# EAGLE board FullBoard (EAGLE 9.3.2), part 1 of 2
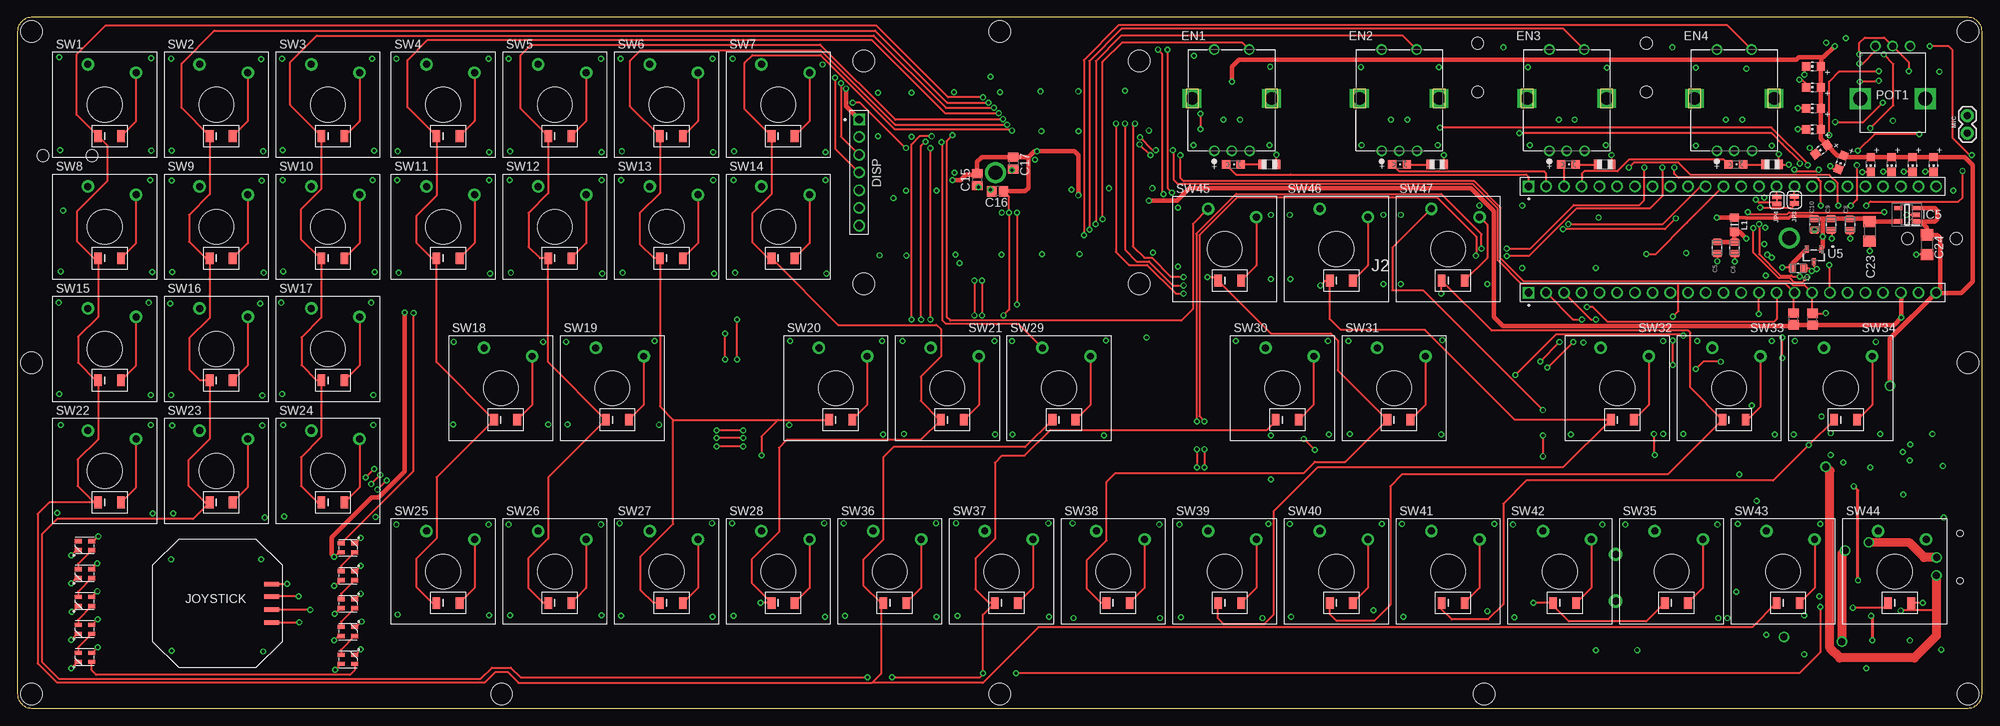
[diagram p3: board, top side]
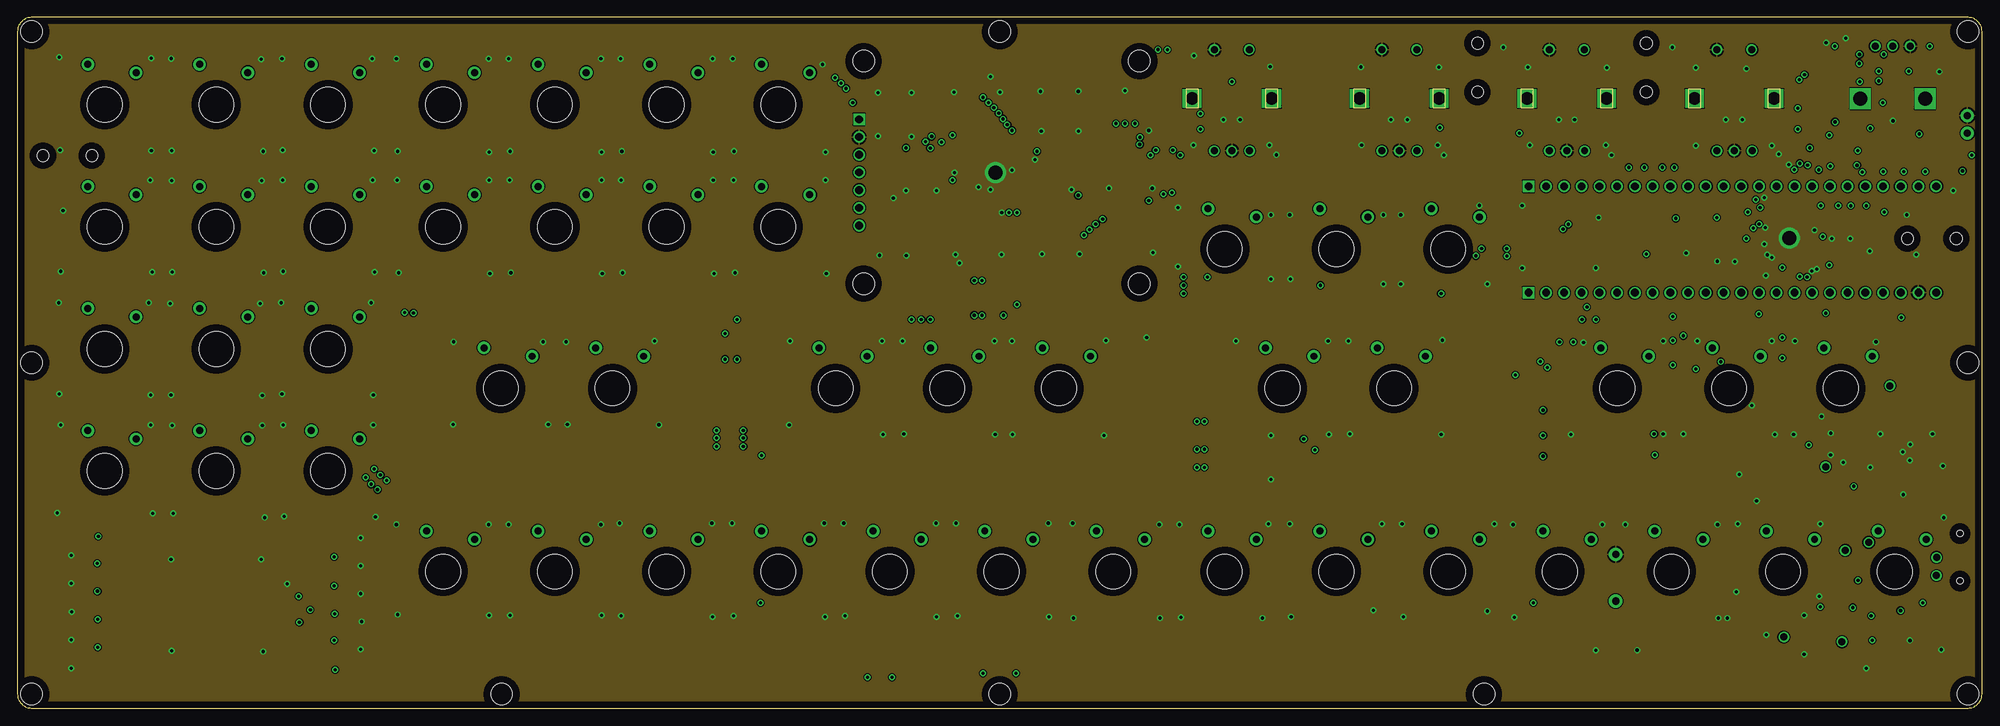
[diagram p4: board, inner layer Route2]
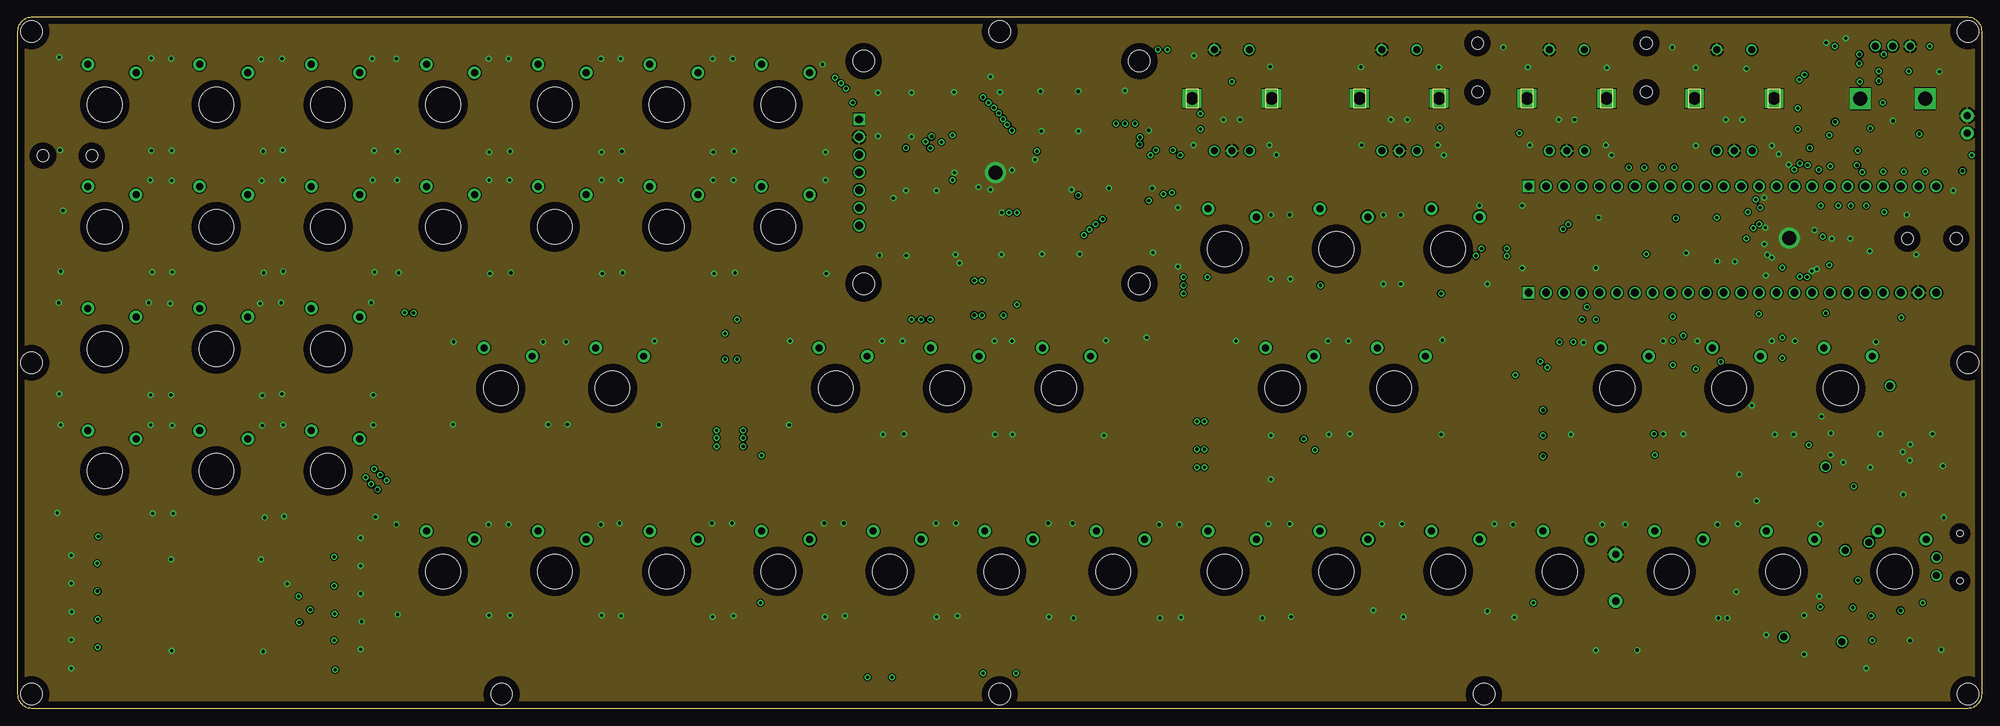
[diagram p5: board, inner layer Route15]
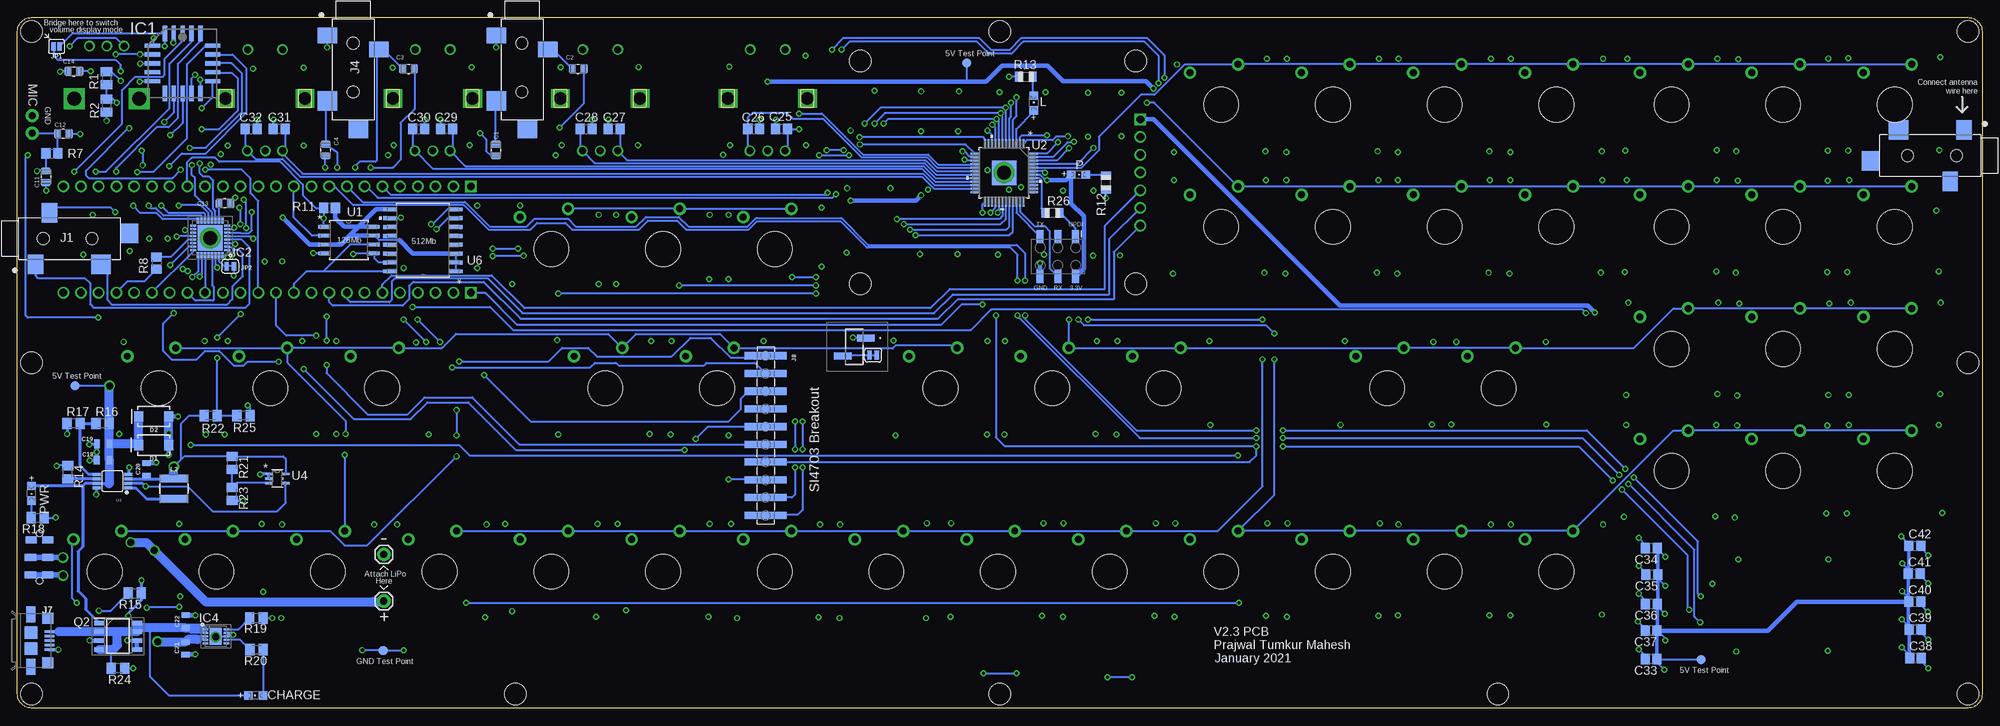
[diagram p6: board, bottom side, seen from below]

Size 281.5 x 99 mm. Coordinates in mm from the lower left corner, seen from the top.
Outline: 0,97 0,2 arc90 2,0 279.5,0 arc90 281.5,2 281.5,97 arc90 279.5,99 2,99 arc90 0,97
Copper layers (1+2*15+16): Top 0.035mm / dielectric 0.2mm / Route2 0.0175mm / dielectric 1.065mm / Route15 0.0175mm / dielectric 0.2mm / Bottom 0.035mm
Design rules "default *": minimum track width 6mil, minimum drill 0.35mm, track to track 6mil, track to pad 6mil, pad to pad 6mil, via to via 6mil, smd to smd 6mil, copper to edge 40mil, drill to drill 6mil, minimum pad ring 10mil, minimum via ring 8mil, stop-mask expansion 4mil, vias tented up to drill 0mil, thermal gap 10mil
Holes 3.1 mm at 121.25,92.74 160.75,92.74 160.75,60.83 121.25,60.83 2,97 2,2 279.5,2 279.5,97 140.75,2 140.75,97 2,49.5 279.5,49.5 210.12,2 69.38,2

## Footprints (pad centres in the part's own frame; a part is rotated, then mirrored left to right if it is on the bottom)
M208770246R = smd 1 x 2.51: 1 -1.27,1.655; 2 1.27,-1.655
SMT-JUMPER_2_NC_TRACE_SILK = smd 0.635 x 1.27: 1 -0.508,0; 2 0.508,0
CAP_0805 = smd 1.05 x 1.38: 1 -0.84,0; 2 0.84,0
C0805 = smd 1.3 x 1.5: 1 -0.85,0; 2 0.85,0
0805 = smd 0.8 x 1.2: 1 -0.9,0; 2 0.9,0
C1206 = smd 1.6 x 1.8: 1 -1.4,0; 2 1.4,0
CHIPLED_0805 = smd 1.2 x 1.2: A 0,-1.05; C 0,1.05
SMA-DIODE = smd 1.27 x 1.47: A -2.15,0; C 2.15,0
61300711121 = drill 1.1 square: 1 -7.62,0 | drill 1.1: 2 -5.08,0; 3 -2.54,0; 4 0,0; 5 2.54,0; 6 5.08,0; 7 7.62,0
PEC11R-4215K-S0024 = drill 1: 1 -2.5,7; 2 2.5,7; A -2.5,-7.5; B 2.55,-7.5; C 0,-7.5 | drill 1.8 square: M1 -5.7,0; M2 5.7,0
PLCC20S = smd 0.6 x 2.2: 1 0,4.3; 2 -1.27,4.3; 3 -2.54,4.3; 9 -2.54,-4.3; 10 -1.27,-4.3; 11 0,-4.3; 12 1.27,-4.3; 13 2.54,-4.3; 19 2.54,4.3; 20 1.27,4.3 | smd 2.2 x 0.6: 4 -4.3,2.54; 5 -4.3,1.27; 6 -4.3,0; 7 -4.3,-1.27; 8 -4.3,-2.54; 14 4.3,-2.54; 15 4.3,-1.27; 16 4.3,0; 17 4.3,1.27; 18 4.3,2.54
QFN50P500X500X90-33N = smd 0.85 x 0.3: 1 -2.45,1.75; 2 -2.45,1.25; 3 -2.45,0.75; 4 -2.45,0.25; 5 -2.45,-0.25; 6 -2.45,-0.75; 7 -2.45,-1.25; 8 -2.45,-1.75; 17 2.45,-1.75; 18 2.45,-1.25; 19 2.45,-0.75; 20 2.45,-0.25; 21 2.45,0.25; 22 2.45,0.75; 23 2.45,1.25; 24 2.45,1.75 | smd 0.3 x 0.85: 9 -1.75,-2.45; 10 -1.25,-2.45; 11 -0.75,-2.45; 12 -0.25,-2.45; 13 0.25,-2.45; 14 0.75,-2.45; 15 1.25,-2.45; 16 1.75,-2.45; 25 1.75,2.45; 26 1.25,2.45; 27 0.75,2.45; 28 0.25,2.45; 29 -0.25,2.45; 30 -0.75,2.45; 31 -1.25,2.45; 32 -1.75,2.45 | smd 3.6 x 3.6: 33 0,0
SON50P300X300X100-11N = smd 0.8 x 0.3: 1 -1.5,1; 2 -1.5,0.5; 3 -1.5,0; 4 -1.5,-0.5; 5 -1.5,-1; 6 1.5,-1; 7 1.5,-0.5; 8 1.5,0; 9 1.5,0.5; 10 1.5,1 | smd 1.75 x 2.45: 11 0,0
SOT95P280X145-5N = smd 1.15 x 0.6: 1 -1.25,0.95; 2 -1.25,0; 3 -1.25,-0.95; 4 1.25,-0.95; 5 1.25,0.95
SJ-3524-SMT-TR = smd 2.2 x 2.8: 1 -3.6,-3.7; 3 -1.6,3.7 | smd 2.8 x 2.8: 2 5.8,-3.7 | smd 2.6 x 2.8: 4 9.8,0.75 | hole 1.7: -2.5,0; 4.5,0
61302411121 = drill 1.1 square: 1 -29.21,0 | drill 1.1: 2 -26.67,0; 3 -24.13,0; 4 -21.59,0; 5 -19.05,0; 6 -16.51,0; 7 -13.97,0; 8 -11.43,0; 9 -8.89,0; 10 -6.35,0; 11 -3.81,0; 12 -1.27,0; 13 1.27,0; 14 3.81,0; 15 6.35,0; 16 8.89,0; 17 11.43,0; 18 13.97,0; 19 16.51,0; 20 19.05,0; 21 21.59,0; 22 24.13,0; 23 26.67,0; 24 29.21,0
2X3_SMD = smd 1.02 x 1.9: 1 -2.54,-2.85; 2 -2.54,2.85; 3 0,-2.85; 4 0,2.85; 5 2.54,-2.85; 6 2.54,2.85
1981584-1 = smd 0.4 x 1.35: 1 -1.3,4.1; 2 -0.65,4.1; 3 0,4.1; 4 0.65,4.1; 5 1.3,4.1 | smd 1.8 x 1.8: M1 -1.15,1.45; M2 1.15,1.45 | smd 2.3 x 1.3: S1 -3.75,1.45; S2 3.75,1.45 | smd 1.6 x 1.6: S3 -3.2,3.885; S4 3.2,3.885
1X10_SMD_MALE = smd 1.02 x 6: 1 0,0; 2 2.54,0; 3 5.08,0; 4 7.62,0; 5 10.16,0; 6 12.7,0; 7 15.24,0; 8 17.78,0; 9 20.32,0; 10 22.86,0
1X01 = drill 1.016 pad 1.88: 1 0,0
SMT-JUMPER_2_NO_SILK = smd 0.635 x 1.27: 1 -0.406,0; 2 0.406,0
RC-MASTER-SMD_L0805MP = smd 1.2 x 1.3: 1 -1.016,0; 2 1.016,0
INDUCTOR_4X4MM = smd 4.089 x 1.143: P$1 0,1.473; P$2 0,-1.473
CHIP-LED0805 = smd 1.2 x 1.2: A 0,-1.05; C 0,1.05
1X02 = drill 1.016 pad 1.88: 1 0,0; 2 2.54,0
PO915N_POT = drill 1: ADJ 0,-7.5; V1 -2.5,-7.5; V2 2.5,-7.5 | drill 2 square: P$4 -4.65,0; P$5 4.65,0
SOIC127P600X175-8N = smd 1.5 x 0.65: 1 -2.7,1.905; 2 -2.7,0.635; 3 -2.7,-0.635; 4 -2.7,-1.905; 5 2.7,-1.905; 6 2.7,-0.635; 7 2.7,0.635; 8 2.7,1.905
M0805 = smd 1.3 x 1.6: 1 -0.95,0; 2 0.95,0
R0805 = smd 1.1 x 1.4: 1 -1,0; 2 1,0
R0805' = smd 1.3 x 1.5: 1 -0.85,0; 2 0.85,0
GATERON_LP_PLAIN = drill 1 pad 1.778: 1 -2.4,5.8; SW2 4.5,4.6 | smd 1.1 x 1.65: 2 -0.95,-4.5; A 2.35,-4.5 | hole 5: 0,0
PAD.03X.05 = smd 1.27 x 1.27: P$1 0,0
WIN_S-8_WIN = smd 1.499 x 0.533: 1 -3.658,1.905; 2 -3.658,0.635; 3 -3.658,-0.635; 4 -3.658,-1.905; 5 3.658,-1.905; 6 3.658,-0.635; 7 3.658,0.635; 8 3.658,1.905
TQFP48_7X7MC_MCH = smd 1.341 x 0.279: 1 -4.176,2.75; 2 -4.176,2.25; 3 -4.176,1.75; 4 -4.176,1.25; 5 -4.176,0.75; 6 -4.176,0.25; 7 -4.176,-0.25; 8 -4.176,-0.75; 9 -4.176,-1.25; 10 -4.176,-1.75; 11 -4.176,-2.25; 12 -4.176,-2.75; 25 4.176,-2.75; 26 4.176,-2.25; 27 4.176,-1.75; 28 4.176,-1.25; 29 4.176,-0.75; 30 4.176,-0.25; 31 4.176,0.25; 32 4.176,0.75; 33 4.176,1.25; 34 4.176,1.75; 35 4.176,2.25; 36 4.176,2.75 | smd 0.279 x 1.341: 13 -2.75,-4.176; 14 -2.25,-4.176; 15 -1.75,-4.176; 16 -1.25,-4.176; 17 -0.75,-4.176; 18 -0.25,-4.176; 19 0.25,-4.176; 20 0.75,-4.176; 21 1.25,-4.176; 22 1.75,-4.176; 23 2.25,-4.176; 24 2.75,-4.176; 37 2.75,4.176; 38 2.25,4.176; 39 1.75,4.176; 40 1.25,4.176; 41 0.75,4.176; 42 0.25,4.176; 43 -0.25,4.176; 44 -0.75,4.176; 45 -1.25,4.176; 46 -1.75,4.176; 47 -2.25,4.176; 48 -2.75,4.176 | smd 3.505 x 3.505: EPAD 0,0
MSOP8 = smd 0.4 x 1.1: 1 -0.975,-2.25; 2 -0.325,-2.25; 3 0.325,-2.25; 4 0.975,-2.25; 5 0.975,2.25; 6 0.325,2.25; 7 -0.325,2.25; 8 -0.975,2.25
21-0076E_MXM-M = smd 1.079 x 0.305: 1 -1.213,0.65; 2 -1.213,0; 3 -1.213,-0.65; 4 1.213,-0.65; 5 1.213,0.65
SOT-23_DIO-L = smd 0.53 x 1.01: 1 -1.025,-0.895; 2 1.025,-0.895; 3 0,0.895
SO3016_SPA-M = smd 1.968 x 0.559: 1 -4.731,4.445; 2 -4.731,3.175; 3 -4.731,1.905; 4 -4.731,0.635; 5 -4.731,-0.635; 6 -4.731,-1.905; 7 -4.731,-3.175; 8 -4.731,-4.445; 9 4.731,-4.445; 10 4.731,-3.175; 11 4.731,-1.905; 12 4.731,-0.635; 13 4.731,0.635; 14 4.731,1.905; 15 4.731,3.175; 16 4.731,4.445
JS202011JAQN = smd 1 x 1.6: P$1 0,0; P$2 2.5,0; P$3 5,0; P$4 0,-2.4; P$5 2.5,-2.5; P$6 5,-2.5 | hole 0.9: -0.9,-1.2; 5.9,-1.2
PSP_JOYSTICK = smd 2.159 x 0.635: GND 7.75,2.75; POWER 7.75,-0.917; X 7.75,-2.75; Y 7.75,0.917
SK6805-2427 = smd 1 x 0.6: DIN 0.375,1.85; DOUT 2.325,0.55; GND 2.325,1.85; VCC 0.375,0.55

## Placement (x,y rotation side)
ANT  M20-8770246R  [M208770246R]  161.6,51.77 270 bottom
BRD_ANT  JUMPER-SMT_2_NC_TRACE_SILK  [SMT-JUMPER_2_NC_TRACE_SILK]  158.9,50.6 0 bottom
C1  2.2uF  [CAP_0805]  212.95,80 270 bottom
C2  2.2uF  [CAP_0805]  201.16,91.65 0 bottom
C3  2.2uF  [CAP_0805]  225.46,91.65 0 bottom
C4  2.2uF  [CAP_0805]  237.35,80 270 bottom
C5  0.1uF  [CAP_0805]  243.55,66 90 top
C6  2.2uF  [CAP_0805]  246.05,65.98 90 top
C7  2.2uF  [CAP_0805]  255.14,63.05 180 top
C8  0.1uF  [CAP_0805]  262.57,69.3 270 top
C9  0.1uF  [CAP_0805]  259.87,69.32 270 top
C10  2.2uF  [CAP_0805]  257.47,69.34 270 top
C11  2,2uF  [CAP_0805]  277.43,76.16 270 bottom
C12  0.1uF  [CAP_0805]  274.92,82.33 180 bottom
C13  0.15uF  [CAP_0805]  251.8,72.33 180 bottom
C14  0.1uF  [CAP_0805]  273.42,91.27 0 bottom
C15  100nF  [C0805]  137.51,75.77 270 top
C16  100nF  [C0805]  140.45,74.09 180 top
C17  100nF  [C0805]  142.71,78.13 270 top
C18  22uF  [0805]  269.24,35.51 180 bottom
C19  22uF  [0805]  269.23,37.91 180 bottom
C20  22uF  [0805]  262.99,34.22 90 bottom
C21  22uF  [0805]  257.41,8.59 270 bottom
C22  22uF  [0805]  257.39,12.4 90 bottom
C23  1uF  [C1206]  265.39,68.35 270 top
C24  1uF  [C1206]  273.59,66.43 270 top
C25  100nF  [C0805]  172,83 180 bottom
C26  100nF  [C0805]  176,83 0 bottom
C27  100nF  [C0805]  196,83 180 bottom
C28  100nF  [C0805]  200,83 0 bottom
C29  100nF  [C0805]  220,83 180 bottom
C30  100nF  [C0805]  224,83 0 bottom
C31  100nF  [C0805]  244,83 180 bottom
C32  100nF  [C0805]  248,83 0 bottom
C33  .1uF  [C0805]  47.42,7 180 bottom
C34  .1uF  [C0805]  47.37,22.9 180 bottom
C35  .1uF  [C0805]  47.32,19.1 180 bottom
C36  .1uF  [C0805]  47.37,14.9 180 bottom
C37  .1uF  [C0805]  47.42,11.1 180 bottom
C38  .1uF  [C0805]  9.53,7.2 0 bottom
C39  .1uF  [C0805]  9.6,11.25 0 bottom
C40  .1uF  [C0805]  9.65,15.25 0 bottom
C41  .1uF  [C0805]  9.7,19.25 0 bottom
C42  .1uF  [C0805]  9.65,23.25 0 bottom
CHARGE  [CHIPLED_0805]  247.36,1.81 90 bottom
D1  3A/40V/500mV  [SMA-DIODE]  261.99,37.69 180 bottom
D2  3A/40V/500mV  [SMA-DIODE]  261.97,41.79 180 bottom
DISP  61300711121  [61300711121]  120.6,76.78 270 top
EN1  PEC11R-4215K-S0024  [PEC11R-4215K-S0024]  174,87.38 0 top
EN2  PEC11R-4215K-S0024  [PEC11R-4215K-S0024]  198,87.38 0 top
EN3  PEC11R-4215K-S0024  [PEC11R-4215K-S0024]  222,87.38 0 top
EN4  PEC11R-4215K-S0024  [PEC11R-4215K-S0024]  246,87.38 0 top
IC1  LM3914V  [PLCC20S]  257.83,92.41 0 bottom
IC2  SGTL5000XNAA3  [QFN50P500X500X90-33N]  253.88,67.4 180 bottom
IC4  MCP73113-16SI_MF  [SON50P300X300X100-11N]  253.08,10.29 0 bottom
IC5  NCP163ASN330T1G  [SOT95P280X145-5N]  270.73,70.71 180 top
J1  SJ-3524-SMT-TR  [SJ-3524-SMT-TR]  275.3,67.3 0 bottom
J2  Teensy2  [61302411121]  245.73,59.55 0 top
J3  Teensy1  [61302411121]  245.73,74.79 0 top
J4  SJ-3524-SMT-TR  [SJ-3524-SMT-TR]  233.4,92.8 270 bottom
J5  [2X3_SMD]  132.42,64.73 180 bottom
J7  1981584-1  [1981584-1]  281.03,9.68 270 bottom
J8  [1X10_SMD_MALE]  174.3,50.5 270 bottom
J9  SJ-3524-SMT-TR  [SJ-3524-SMT-TR]  209.2,92.8 270 bottom
J10  SJ-3524-SMT-TR  [SJ-3524-SMT-TR]  6.16,79.18 180 bottom
J11  [1X01]  229,15.34 0 bottom
J12  [1X01]  229,22.04 0 bottom
JP1  JUMPER-SMT_2_NO_SILK  [SMT-JUMPER_2_NO_SILK]  275.9,94.83 180 bottom
JP2  JUMPER-SMT_2_NC_TRACE_SILK  [SMT-JUMPER_2_NC_TRACE_SILK]  251.01,63.33 180 bottom
JP3  JUMPER-SMT_2_NC_TRACE_SILK  [SMT-JUMPER_2_NC_TRACE_SILK]  254.59,72.85 270 top
JP4  JUMPER-SMT_2_NC_TRACE_SILK  [SMT-JUMPER_2_NC_TRACE_SILK]  252.09,72.78 270 top
L  [CHIPLED_0805]  135.88,86.74 0 bottom
L1  [RC-MASTER-SMD_L0805MP]  246.01,69.3 270 top
L2  2.2UH3A  [INDUCTOR_4X4MM]  259.08,31.46 0 bottom
LED1  [CHIP-LED0805]  274.56,77.92 180 top
LED2  [CHIP-LED0805]  271.56,77.92 180 top
LED3  [CHIP-LED0805]  268.56,77.92 180 top
LED4  [CHIP-LED0805]  265.56,77.92 180 top
LED5  [CHIP-LED0805]  261.29,78.23 159.7 top
LED6  [CHIP-LED0805]  258.46,80.05 127.4 top
LED7  [CHIP-LED0805]  257.34,82.97 90 top
LED8  [CHIP-LED0805]  257.34,85.97 90 top
LED9  [CHIP-LED0805]  257.34,88.97 90 top
LED10  [CHIP-LED0805]  257.34,91.97 90 top
LED11  [CHIPLED_0805]  174.23,77.92 270 top
LED12  [CHIPLED_0805]  198.03,77.92 270 top
LED13  [CHIPLED_0805]  222.23,77.92 270 top
LED14  [CHIPLED_0805]  246.23,77.92 270 top
MIC  [1X02]  279.4,82.4 90 top
P  [CHIPLED_0805]  129.46,76.46 270 bottom
POT1  P0915N_POT  [PO915N_POT]  268.71,87.38 180 top
PWR  [CHIPLED_0805]  279.5,30.8 180 bottom
Q2  DMG9926USD-13  [SOIC127P600X175-8N]  267.08,10.31 0 bottom
R1  2.2K  [M0805]  268.75,90.3 90 bottom
R2  3.3K  [M0805]  268.75,86.35 90 bottom
R3  220  [R0805]  179.4,77.92 180 top
R4  220  [R0805]  203.42,77.92 180 top
R5  220  [R0805]  227.44,77.92 180 top
R6  220  [R0805]  251.4,77.92 180 top
R7  2.2k  [R0805']  276.56,79.5 0 bottom
R8  100  [R0805']  261.55,63.8 270 bottom
R9  2.2k  [R0805']  254.5,55.79 90 top
R10  2.2k  [R0805']  257.2,55.74 90 top
R11  10k  [R0805']  236.79,71.7 180 bottom
R12  10k  [R0805]  125.52,75.32 90 bottom
R13  10k  [R0805]  137,90.52 0 bottom
R14  DNP  [M0805]  274.31,33.8 270 bottom
R15  750K  [M0805]  264.7,16.47 180 bottom
R16  750K  [M0805]  269.3,40.79 0 bottom
R17  100K  [M0805]  273.45,40.79 0 bottom
R18  4.7K  [M0805]  278.59,27.29 180 bottom
R19  1.15K  [M0805]  247.25,12.91 180 bottom
R20  470  [M0805]  247.24,8.39 180 bottom
R21  3.2M  [M0805]  250.71,35.15 270 bottom
R22  4K  [M0805]  253.8,41.9 0 bottom
R23  1.82M  [M0805]  250.71,30.7 270 bottom
R24  100K  [M0805]  267.1,5.69 0 bottom
R25  10K  [M0805]  249.1,41.9 0 bottom
R26  4.7K  [R0805]  133.2,71 0 bottom
SW1  GATERON_LOW_PROFILE  [GATERON_LP_PLAIN]  12.5,86.48 0 top
SW2  GATERON_LOW_PROFILE  [GATERON_LP_PLAIN]  28.5,86.48 0 top
SW3  GATERON_LOW_PROFILE  [GATERON_LP_PLAIN]  44.5,86.48 0 top
SW4  GATERON_LOW_PROFILE  [GATERON_LP_PLAIN]  61,86.48 0 top
SW5  GATERON_LOW_PROFILE  [GATERON_LP_PLAIN]  77,86.48 0 top
SW6  GATERON_LOW_PROFILE  [GATERON_LP_PLAIN]  93,86.48 0 top
SW7  GATERON_LOW_PROFILE  [GATERON_LP_PLAIN]  109,86.48 0 top
SW8  GATERON_LOW_PROFILE  [GATERON_LP_PLAIN]  12.5,68.98 0 top
SW9  GATERON_LOW_PROFILE  [GATERON_LP_PLAIN]  28.5,68.98 0 top
SW10  GATERON_LOW_PROFILE  [GATERON_LP_PLAIN]  44.5,68.98 0 top
SW11  GATERON_LOW_PROFILE  [GATERON_LP_PLAIN]  61,68.98 0 top
SW12  GATERON_LOW_PROFILE  [GATERON_LP_PLAIN]  77,68.98 0 top
SW13  GATERON_LOW_PROFILE  [GATERON_LP_PLAIN]  93,68.98 0 top
SW14  GATERON_LOW_PROFILE  [GATERON_LP_PLAIN]  109,68.98 0 top
SW15  GATERON_LOW_PROFILE  [GATERON_LP_PLAIN]  12.5,51.48 0 top
SW16  GATERON_LOW_PROFILE  [GATERON_LP_PLAIN]  28.5,51.48 0 top
SW17  GATERON_LOW_PROFILE  [GATERON_LP_PLAIN]  44.5,51.48 0 top
SW18  GATERON_LOW_PROFILE  [GATERON_LP_PLAIN]  69.25,45.83 0 top
SW19  GATERON_LOW_PROFILE  [GATERON_LP_PLAIN]  85.25,45.83 0 top
SW20  GATERON_LOW_PROFILE  [GATERON_LP_PLAIN]  117.25,45.83 0 top
SW21  GATERON_LOW_PROFILE  [GATERON_LP_PLAIN]  133.25,45.83 0 top
SW22  GATERON_LOW_PROFILE  [GATERON_LP_PLAIN]  12.5,33.98 0 top
SW23  GATERON_LOW_PROFILE  [GATERON_LP_PLAIN]  28.5,33.98 0 top
SW24  GATERON_LOW_PROFILE  [GATERON_LP_PLAIN]  44.5,33.98 0 top
SW25  GATERON_LOW_PROFILE  [GATERON_LP_PLAIN]  61,19.58 0 top
SW26  GATERON_LOW_PROFILE  [GATERON_LP_PLAIN]  77,19.58 0 top
SW27  GATERON_LOW_PROFILE  [GATERON_LP_PLAIN]  93,19.58 0 top
SW28  GATERON_LOW_PROFILE  [GATERON_LP_PLAIN]  109,19.58 0 top
SW29  GATERON_LOW_PROFILE  [GATERON_LP_PLAIN]  149.25,45.83 0 top
SW30  GATERON_LOW_PROFILE  [GATERON_LP_PLAIN]  181.25,45.83 0 top
SW31  GATERON_LOW_PROFILE  [GATERON_LP_PLAIN]  197.25,45.83 0 top
SW32  GATERON_LOW_PROFILE  [GATERON_LP_PLAIN]  229.25,45.83 0 top
SW33  GATERON_LOW_PROFILE  [GATERON_LP_PLAIN]  245.25,45.83 0 top
SW34  GATERON_LOW_PROFILE  [GATERON_LP_PLAIN]  261.25,45.83 0 top
SW35  GATERON_LOW_PROFILE  [GATERON_LP_PLAIN]  237,19.58 0 top
SW36  GATERON_LOW_PROFILE  [GATERON_LP_PLAIN]  125,19.58 0 top
SW37  GATERON_LOW_PROFILE  [GATERON_LP_PLAIN]  141,19.58 0 top
SW38  GATERON_LOW_PROFILE  [GATERON_LP_PLAIN]  157,19.58 0 top
SW39  GATERON_LOW_PROFILE  [GATERON_LP_PLAIN]  173,19.58 0 top
SW40  GATERON_LOW_PROFILE  [GATERON_LP_PLAIN]  189,19.58 0 top
SW41  GATERON_LOW_PROFILE  [GATERON_LP_PLAIN]  205,19.58 0 top
SW42  GATERON_LOW_PROFILE  [GATERON_LP_PLAIN]  221,19.58 0 top
SW43  GATERON_LOW_PROFILE  [GATERON_LP_PLAIN]  253,19.58 0 top
SW44  GATERON_LOW_PROFILE  [GATERON_LP_PLAIN]  269,19.58 0 top
SW45  GATERON_LOW_PROFILE  [GATERON_LP_PLAIN]  173,65.78 0 top
SW46  GATERON_LOW_PROFILE  [GATERON_LP_PLAIN]  189,65.78 0 top
SW47  GATERON_LOW_PROFILE  [GATERON_LP_PLAIN]  205,65.78 0 top
TP1  TEST-POINT3X5  [PAD.03X.05]  40.26,6.95 0 bottom
TP2  TEST-POINT3X5  [PAD.03X.05]  145.49,92.46 0 bottom
TP3  TEST-POINT3X5  [PAD.03X.05]  273.23,46.23 0 bottom
TP4  TEST-POINT3X5  [PAD.03X.05]  229.1,8.25 0 bottom
U1  W25Q128FVSIG  [WIN_S-8_WIN]  234.03,67.09 0 bottom
U2  ATMEGA4809-AFR  [TQFP48_7X7MC_MCH]  140.13,76.73 270 bottom
U3  PAM2401  [MSOP8]  267.89,32.52 90 bottom
U4  MAX6775XKA+21-0076E_MXM-M  [21-0076E_MXM-M]  244.27,32.89 0 bottom
U5  AP7313-15SAG-7SOT-23_DIO-L  [SOT-23_DIO-L]  257.4,64.9 180 top
U6  S25FL512SAGMFIR13SO3016_SPA-M  [SO3016_SPA-M]  223.4,67.05 180 bottom
U$1  JS202011JAQN  [JS202011JAQN]  277.14,24.12 270 bottom
U$2  PSP_JOYSTICK  [PSP_JOYSTICK]  28.67,15.03 0 top
U$25  NEOPIXEL_NANO_2427  [SK6805-2427]  46,21.78 0 top
U$26  NEOPIXEL_NANO_2427  [SK6805-2427]  46,17.78 0 top
U$27  NEOPIXEL_NANO_2427  [SK6805-2427]  46,13.78 0 top
U$36  NEOPIXEL_NANO_2427  [SK6805-2427]  46,9.78 0 top
U$41  NEOPIXEL_NANO_2427  [SK6805-2427]  46,5.78 0 top
U$42  NEOPIXEL_NANO_2427  [SK6805-2427]  11,8.48 180 top
U$43  NEOPIXEL_NANO_2427  [SK6805-2427]  11,12.48 180 top
U$44  NEOPIXEL_NANO_2427  [SK6805-2427]  11,16.48 180 top
U$45  NEOPIXEL_NANO_2427  [SK6805-2427]  11,20.48 180 top
U$46  NEOPIXEL_NANO_2427  [SK6805-2427]  11,24.48 180 top